# EAGLE schematic panda-2 (EAGLE 9.6.2)

## Sheet 1 of 2
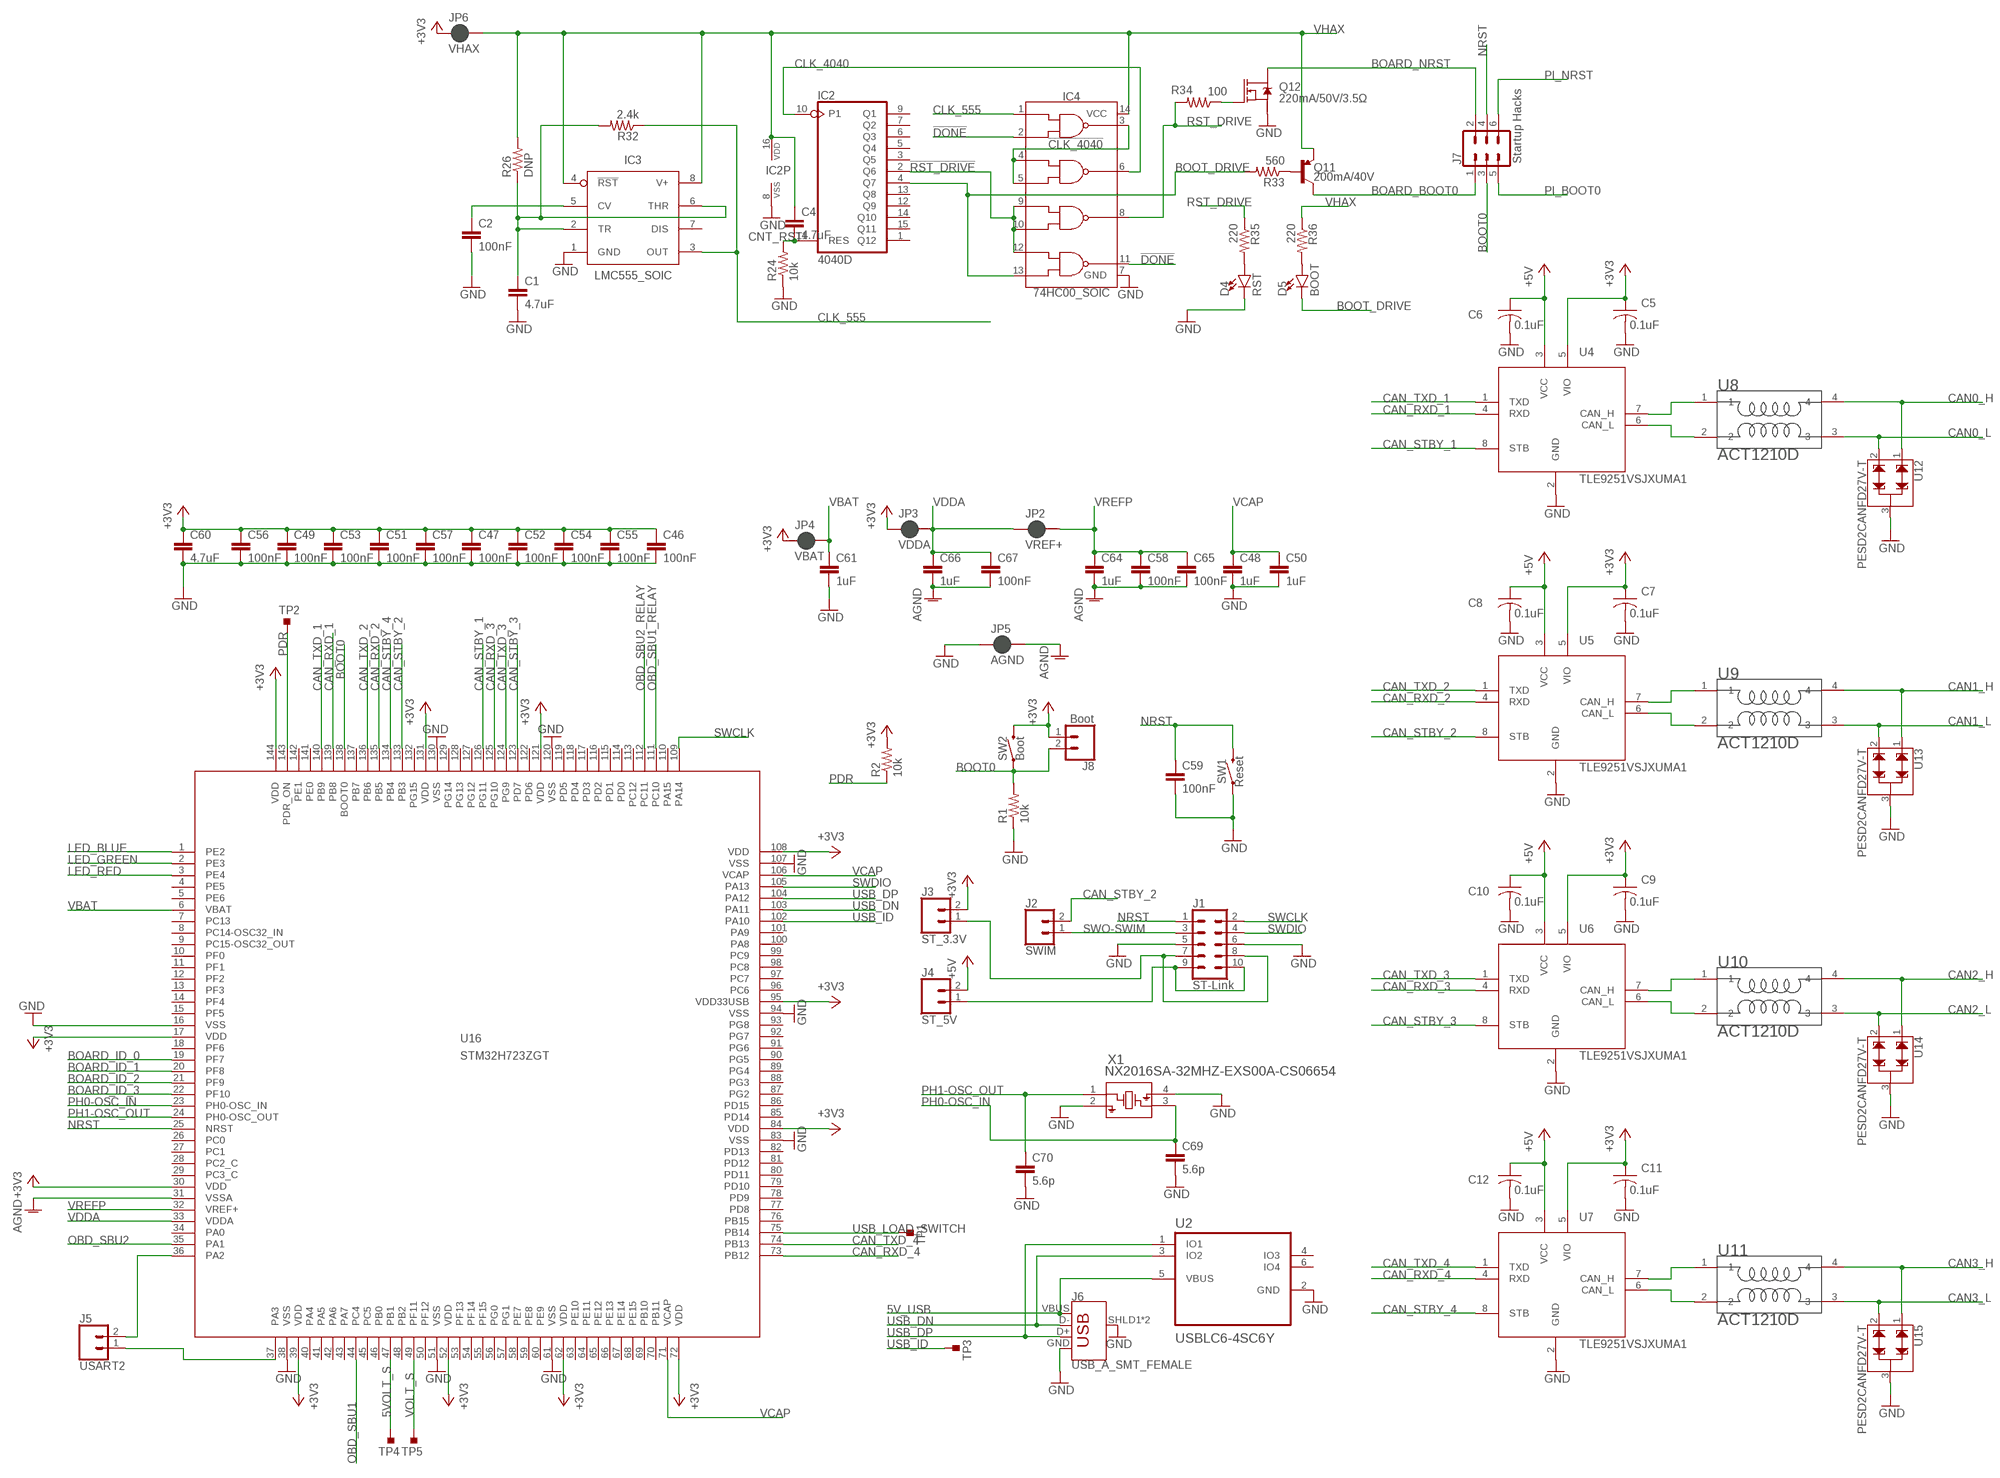
[diagram p0: schematic, sheet 1, part 1 of 2]
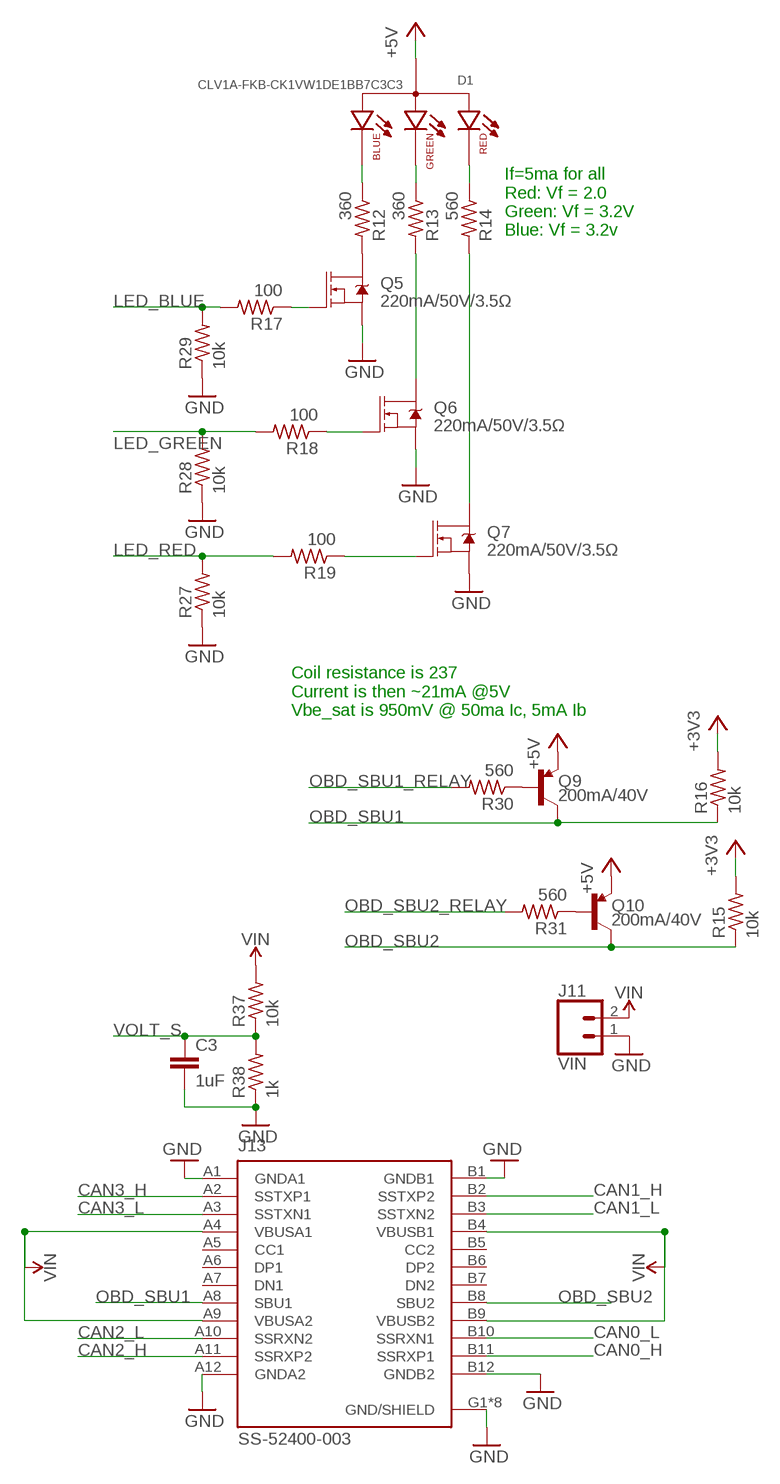
[diagram p1: schematic, sheet 1, part 2 of 2]

### Parts
C1  4.7uF  C-EUC0603  [C0603]
C2  100nF  C-EUC0402  [C0402]
C3  1uF  C-EUC0402  [C0402]
C4  4.7uF  C-EUC0603  [C0603]
C5  0.1uF  C-USC0402  [C0402]
C6  0.1uF  C-USC0402  [C0402]
C7  0.1uF  C-USC0402  [C0402]
C8  0.1uF  C-USC0402  [C0402]
C9  0.1uF  C-USC0402  [C0402]
C10  0.1uF  C-USC0402  [C0402]
C11  0.1uF  C-USC0402  [C0402]
C12  0.1uF  C-USC0402  [C0402]
C46  100nF  C-EUC0402  [C0402]
C47  100nF  C-EUC0402  [C0402]
C48  1uF  C-EUC0402  [C0402]
C49  100nF  C-EUC0402  [C0402]
C50  1uF  C-EUC0402  [C0402]
C51  100nF  C-EUC0402  [C0402]
C52  100nF  C-EUC0402  [C0402]
C53  100nF  C-EUC0402  [C0402]
C54  100nF  C-EUC0402  [C0402]
C55  100nF  C-EUC0402  [C0402]
C56  100nF  C-EUC0402  [C0402]
C57  100nF  C-EUC0402  [C0402]
C58  100nF  C-EUC0402  [C0402]
C59  100nF  C-EUC0402  [C0402]
C60  4.7uF  C-EUC0603  [C0603]
C61  1uF  C-EUC0402  [C0402]
C64  1uF  C-EUC0402  [C0402]
C65  100nF  C-EUC0402  [C0402]
C66  1uF  C-EUC0402  [C0402]
C67  100nF  C-EUC0402  [C0402]
C69  5.6p  C-EUC0402  [C0402]
C70  5.6p  C-EUC0402  [C0402]
D1  CLV1A-FKB-CK1VW1DE1BB7C3C3  [LED_CLV1A-FKB-CK1VW1DE1BB7C3C3]
D4  RST  LED-RED0603  [LED-0603]
D5  BOOT  LED-RED0603  [LED-0603]
IC2  4040D  [SO16]
IC3  LMC555_SOIC  [SOIC127P599X175-8N]
IC4  74HC00_SOIC  [SOIC127P600X175-14N]
J1  ST-Link  CONN_05X2SHD-NS  [2X5-SHROUDED-NS]
J2  SWIM  CONN_02  [1X02]
J3  ST_3.3V  CONN_02  [1X02]
J4  ST_5V  CONN_02  [1X02]
J5  USART2  CONN_02  [1X02]
J6  USB_A_SMT_FEMALE  [USB-A-S-SILK-FEMALE]
J7  Startup Hacks  CONN_03X2FEMALE  [2X3]
J8  Boot  CONN_02  [1X02]
J11  VIN  CONN_02  [1X02]
J13  SS-52400-003  [BELFUSE_SS-52400-003]
JP2  VREF+  JUMPER-SMT_2_NC_PASTE_SILK  [SMT-JUMPER_2_NC_PASTE_SILK]
JP3  VDDA  JUMPER-SMT_2_NC_PASTE_SILK  [SMT-JUMPER_2_NC_PASTE_SILK]
JP4  VBAT  JUMPER-SMT_2_NC_PASTE_SILK  [SMT-JUMPER_2_NC_PASTE_SILK]
JP5  AGND  JUMPER-SMT_2_NC_PASTE_SILK  [SMT-JUMPER_2_NC_PASTE_SILK]
JP6  VHAX  JUMPER-SMT_2_NC_PASTE_SILK  [SMT-JUMPER_2_NC_PASTE_SILK]
Q5  220mA/50V/3.5Ω  MOSFET-NCH-BSS138  [SOT23-3]
Q6  220mA/50V/3.5Ω  MOSFET-NCH-BSS138  [SOT23-3]
Q7  220mA/50V/3.5Ω  MOSFET-NCH-BSS138  [SOT23-3]
Q9  200mA/40V  TRANS_PNP-PMBT3906|MMBT3906L  [SOT23-3]
Q10  200mA/40V  TRANS_PNP-PMBT3906|MMBT3906L  [SOT23-3]
Q11  200mA/40V  TRANS_PNP-PMBT3906|MMBT3906L  [SOT23-3]
Q12  220mA/50V/3.5Ω  MOSFET-NCH-BSS138  [SOT23-3]
R1  10k  R-US_R0402  [R0402]
R2  10k  R-US_R0402  [R0402]
R12  360  R-US_R0402  [R0402]
R13  360  R-US_R0402  [R0402]
R14  560  R-US_R0402  [R0402]
R15  10k  R-US_R0402  [R0402]
R16  10k  R-US_R0402  [R0402]
R17  100  R-US_R0402  [R0402]
R18  100  R-US_R0402  [R0402]
R19  100  R-US_R0402  [R0402]
R24  10k  R-US_R0402  [R0402]
R26  DNP  R-US_R0402  [R0402]
R27  10k  R-US_R0402  [R0402]
R28  10k  R-US_R0402  [R0402]
R29  10k  R-US_R0402  [R0402]
R30  560  R-US_R0402  [R0402]
R31  560  R-US_R0402  [R0402]
R32  2.4k  R-US_R0402  [R0402]
R33  560  R-US_R0402  [R0402]
R34  100  R-US_R0402  [R0402]
R35  220  R-US_R0402  [R0402]
R36  220  R-US_R0402  [R0402]
R37  10k  R-US_R0402  [R0402]
R38  1k  R-US_R0402  [R0402]
SW1  Reset  MOMENTARY-SWITCH-SPST-PTH-6.0MM  [TACTILE_SWITCH_PTH_6.0MM]
SW2  Boot  MOMENTARY-SWITCH-SPST-PTH-6.0MM  [TACTILE_SWITCH_PTH_6.0MM]
TP1  USB_LOAD_SWITCH  TESTPOINT_TPS-SMD-10SN  [TESTPOINT_SMD-10SN]
TP2  PDR_ON  TESTPOINT_TPS-SMD-10SN  [TESTPOINT_SMD-10SN]
TP3  USB_ID  TESTPOINT_TPS-SMD-10SN  [TESTPOINT_SMD-10SN]
TP4  5VOUT_S  TESTPOINT_TPS-SMD-10SN  [TESTPOINT_SMD-10SN]
TP5  VOLT_S  TESTPOINT_TPS-SMD-10SN  [TESTPOINT_SMD-10SN]
U2  USBLC6-4SC6Y  [SOT95P280X145-6N]
U4  TLE9251VSJXUMA1  [SOIC8]
U5  TLE9251VSJXUMA1  [SOIC8]
U6  TLE9251VSJXUMA1  [SOIC8]
U7  TLE9251VSJXUMA1  [SOIC8]
U8  ACT1210D  [ACT1210-101-2P-TL]
U9  ACT1210D  [ACT1210-101-2P-TL]
U10  ACT1210D  [ACT1210-101-2P-TL]
U11  ACT1210D  [ACT1210-101-2P-TL]
U12  PESD2CANFD27V-T  [DBZ_R-PDSO-G3]
U13  PESD2CANFD27V-T  [DBZ_R-PDSO-G3]
U14  PESD2CANFD27V-T  [DBZ_R-PDSO-G3]
U15  PESD2CANFD27V-T  [DBZ_R-PDSO-G3]
U16  STM32H723ZGT  [LQFP-144]
X1  NX2016SA-32MHZ-EXS00A-CS06654  [NX2016SA_NDK]

### Nets
5V_USB: J6.VBUS U2.5(VBUS) ; also sheet 2
5VOLT_S: TP4.TP U16.47(PB1)
!CLK_4040: IC4.3(1Y) IC4.4(2A) IC4.5(2B)
!DONE: IC4.2(1B) IC4.11(4Y)
!RST_DRIVE: IC2.2(Q6) IC4.9(3A) IC4.10(3B) IC4.12(4A)
+3V3: C5.1 C7.1 C9.1 C11.1 C46.1 C47.1 C49.1 C51.1 C52.1 C53.1 C54.1 C55.1 C56.1 C57.1 C60.1 J3.2 J8.1 JP3.1 JP4.1 JP6.1 R2.2 R15.2 R16.2 SW2.3 U4.5(VIO) U5.5(VIO) U6.5(VIO) U7.5(VIO) U16.17(VDD) U16.30(VDD) U16.39(VDD) U16.52(VDD) U16.62(VDD) U16.72(VDD) U16.84(VDD) U16.95(VDD33USB) U16.108(VDD) U16.121(VDD) U16.131(VDD) U16.144(VDD) ; also sheet 2
+5V: C6.1 C8.1 C10.1 C12.1 D1.2(A) J4.2 Q9.2(E) Q10.2(E) U4.3(VCC) U5.3(VCC) U6.3(VCC) U7.3(VCC) ; also sheet 2
AGND: C58.2 C64.2 C65.2 C66.2 C67.2 JP5.2 U16.31(VSSA)
BOARD_BOOT0: J7.1 Q11.3(C)
BOARD_ID_0: U16.19(PF7)
BOARD_ID_1: U16.20(PF8)
BOARD_ID_2: U16.21(PF9)
BOARD_ID_3: U16.22(PF10)
BOARD_NRST: J7.2 Q12.3(D)
BOOT0: J7.3 J8.2 R1.2 SW2.1 U16.138(BOOT0)
BOOT_DRIVE: D5.C IC2.4(Q7) IC4.13(4B) R33.2
CAN0_H: J13.B11(SSRXP1) U8.4 U12.1
CAN0_L: J13.B10(SSRXN1) U8.3 U12.2
CAN1_H: J13.B2(SSTXP2) U9.4 U13.1
CAN1_L: J13.B3(SSTXN2) U9.3 U13.2
CAN2_H: J13.A11(SSRXP2) U10.4 U14.1
CAN2_L: J13.A10(SSRXN2) U10.3 U14.2
CAN3_H: J13.A2(SSTXP1) U11.4 U15.1
CAN3_L: J13.A3(SSTXN1) U11.3 U15.2
CAN_RXD_1: U4.4(RXD) U16.139(PB8)
CAN_RXD_2: U5.4(RXD) U16.135(PB5)
CAN_RXD_3: U6.4(RXD) U16.125(PG10)
CAN_RXD_4: U7.4(RXD) U16.73(PB12)
CAN_STBY_1: U4.8(STB) U16.126(PG11)
CAN_STBY_2: J2.2 U5.8(STB) U16.133(PB3)
CAN_STBY_3: U6.8(STB) U16.123(PD7)
CAN_STBY_4: U7.8(STB) U16.134(PB4)
CAN_TXD_1: U4.1(TXD) U16.140(PB9)
CAN_TXD_2: U5.1(TXD) U16.136(PB6)
CAN_TXD_3: U6.1(TXD) U16.124(PG9)
CAN_TXD_4: U7.1(TXD) U16.74(PB13)
CLK_555: IC3.3(OUT) IC4.1(1A) R32.1
CLK_4040: IC2.10(P1) IC4.6(2Y)
CNT_RST: C4.2 IC2.11(RES) R24.2
GND: C1.2 C2.2 C3.2 C5.2 C6.2 C7.2 C8.2 C9.2 C10.2 C11.2 C12.2 C46.2 C47.2 C48.2 C49.2 C50.2 C51.2 C52.2 C53.2 C54.2 C55.2 C56.2 C57.2 C59.2 C60.2 C61.2 C69.2 C70.2 D4.C IC2.8(VSS) IC3.1(GND) IC4.7(GND) J1.5 J1.6 J6.GND J6.SHLD1(SHIELD) J6.SHLD2(SHIELD) J11.1 J13.A1(GNDA1) J13.A12(GNDA2) J13.B1(GNDB1) J13.B12(GNDB2) J13.G1(GND/SHIELD) J13.G2(GND/SHIELD) J13.G3(GND/SHIELD) J13.G4(GND/SHIELD) J13.S1(GND/SHIELD) J13.S2(GND/SHIELD) J13.S3(GND/SHIELD) J13.S4(GND/SHIELD) JP5.1 Q5.2(S) Q6.2(S) Q7.2(S) Q12.2(S) R1.1 R24.1 R27.1 R28.1 R29.1 R38.1 SW1.1 U2.2(GND) U4.2(GND) U5.2(GND) U6.2(GND) U7.2(GND) U12.3 U13.3 U14.3 U15.3 U16.16(VSS) U16.38(VSS) U16.51(VSS) U16.61(VSS) U16.83(VSS) U16.94(VSS) U16.107(VSS) U16.120(VSS) U16.130(VSS) X1.2 X1.4 ; also sheet 2
LED_BLUE: R17.2 R29.2 U16.1(PE2)
LED_GREEN: R18.2 R28.2 U16.2(PE3)
LED_RED: R19.2 R27.2 U16.3(PE4)
N$1: U4.7(CAN_H) U8.1
N$2: U4.6(CAN_L) U8.2
N$3: U5.7(CAN_H) U9.1
N$4: U5.6(CAN_L) U9.2
N$5: U6.7(CAN_H) U10.1
N$6: U6.6(CAN_L) U10.2
N$7: U7.7(CAN_H) U11.1
N$8: U7.6(CAN_L) U11.2
N$9: J1.7 J1.8 J3.1
N$11: J1.9 J1.10 J4.1
N$12: Q5.3(D) R12.2
N$13: D1.3(B_C) R12.1
N$14: D1.4(G_C) R13.1
N$15: D1.1(R_C) R14.1
N$16: Q6.3(D) R13.2
N$17: Q7.3(D) R14.2
N$18: Q9.1(B) R30.1
N$19: Q5.1(G) R17.1
N$20: Q6.1(G) R18.1
N$21: Q7.1(G) R19.1
N$22: D4.A R35.2
N$23: D5.A R36.2
N$29: J5.2 U16.36(PA2)
N$30: J5.1 U16.37(PA3)
N$31: Q10.1(B) R31.1
N$35: C1.1 IC3.2(TR) IC3.6(THR) R26.1 R32.2
N$37: C2.1 IC3.5(CV)
N$44: Q11.1(B) R33.1
N$45: Q12.1(G) R34.1
NRST: C59.1 J1.1 J7.4 SW1.3 U16.25(NRST)
OBD_SBU1: J13.A8(SBU1) Q9.3(C) R16.1 U16.44(PC4)
OBD_SBU1_RELAY: R30.2 U16.111(PC10)
OBD_SBU2: J13.B8(SBU2) Q10.3(C) R15.1 U16.35(PA1)
OBD_SBU2_RELAY: R31.2 U16.112(PC11)
PDR: R2.1 TP2.TP U16.143(PDR_ON)
PH0-OSC_IN: C69.1 U16.23(PH0-OSC_IN) X1.3
PH1-OSC_OUT: C70.1 U16.24(PH0-OSC_OUT) X1.1
PI_BOOT0: J7.5 ; also sheet 2
PI_NRST: J7.6 ; also sheet 2
RST_DRIVE: IC4.8(3Y) R34.2 R35.1
SWCLK: J1.2 U16.109(PA14)
SWDIO: J1.4 U16.105(PA13)
SWO-SWIM: J1.3 J2.1
USB_DN: J6.D- U2.3(IO2) U16.103(PA11)
USB_DP: J6.D+ U2.1(IO1) U16.104(PA12)
USB_ID: TP3.TP U16.102(PA10)
USB_LOAD_SWITCH: TP1.TP U16.75(PB14)
VBAT: C61.1 JP4.2 U16.6(VBAT)
VCAP: C48.1 C50.1 U16.71(VCAP) U16.106(VCAP)
VDDA: C66.1 C67.1 JP2.1 JP3.2 U16.33(VDDA)
VHAX: C4.1 IC2.16(VDD) IC3.4(!RST) IC3.8(V+) IC4.14(VCC) JP6.2 Q11.2(E) R26.2 R36.1
VIN: J11.2 J13.A4(VBUSA1) J13.A9(VBUSA2) J13.B4(VBUSB1) J13.B9(VBUSB2) R37.2
VOLT_S: C3.1 R37.1 R38.2 TP5.TP U16.49(PF11)
VREFP: C58.1 C64.1 C65.1 JP2.2 U16.32(VREF+)
Unconnected: IC2.1(Q12) IC2.3(Q5) IC2.5(Q4) IC2.6(Q3) IC2.7(Q2) IC2.9(Q1) IC2.12(Q9) IC2.13(Q8) IC2.14(Q10) IC2.15(Q11) IC3.7(DIS) J13.A5(CC1) J13.A6(DP1) J13.A7(DN1) J13.B5(CC2) J13.B6(DP2) J13.B7(DN2) U2.4(IO3) U2.6(IO4) U16.4(PE5) U16.5(PE6) U16.7(PC13) U16.8(PC14-OSC32_IN) U16.9(PC15-OSC32_OUT) U16.10(PF0) U16.11(PF1) U16.12(PF2) U16.13(PF3) U16.14(PF4) U16.15(PF5) U16.18(PF6) U16.26(PC0) U16.27(PC1) U16.28(PC2_C) U16.29(PC3_C) U16.34(PA0) U16.40(PA4) U16.41(PA5) U16.42(PA6) U16.43(PA7) U16.45(PC5) U16.46(PB0) U16.48(PB2) U16.50(PF12) U16.53(PF13) U16.54(PF14) U16.55(PF15) U16.56(PG0) U16.57(PG1) U16.58(PE7) U16.59(PE8) U16.60(PE9) U16.63(PE10) U16.64(PE11) U16.65(PE12) U16.66(PE13) U16.67(PE14) U16.68(PE15) U16.69(PB10) U16.70(PB11) U16.76(PB15) U16.77(PD8) U16.78(PD9) U16.79(PD10) U16.80(PD11) U16.81(PD12) U16.82(PD13) U16.85(PD14) U16.86(PD15) U16.87(PG2) U16.88(PG3) U16.89(PG4) U16.90(PG5) U16.91(PG6) U16.92(PG7) U16.93(PG8) U16.96(PC6) U16.97(PC7) U16.98(PC8) U16.99(PC9) U16.100(PA8) U16.101(PA9) U16.110(PA15) U16.113(PC12) U16.114(PD0) U16.115(PD1) U16.116(PD2) U16.117(PD3) U16.118(PD4) U16.119(PD5) U16.122(PD6) U16.127(PG12) U16.128(PG13) U16.129(PG14) U16.132(PG15) U16.137(PB7) U16.141(PE0) U16.142(PE1)

### Notes on the sheet
- If=5ma for all
  Red: Vf = 2.0
  Green: Vf = 3.2V
  Blue: Vf = 3.2v
- Coil resistance is 237
  Current is then ~21mA @5V
  Vbe_sat is 950mV @ 50ma Ic, 5mA Ib

## Sheet 2 of 2
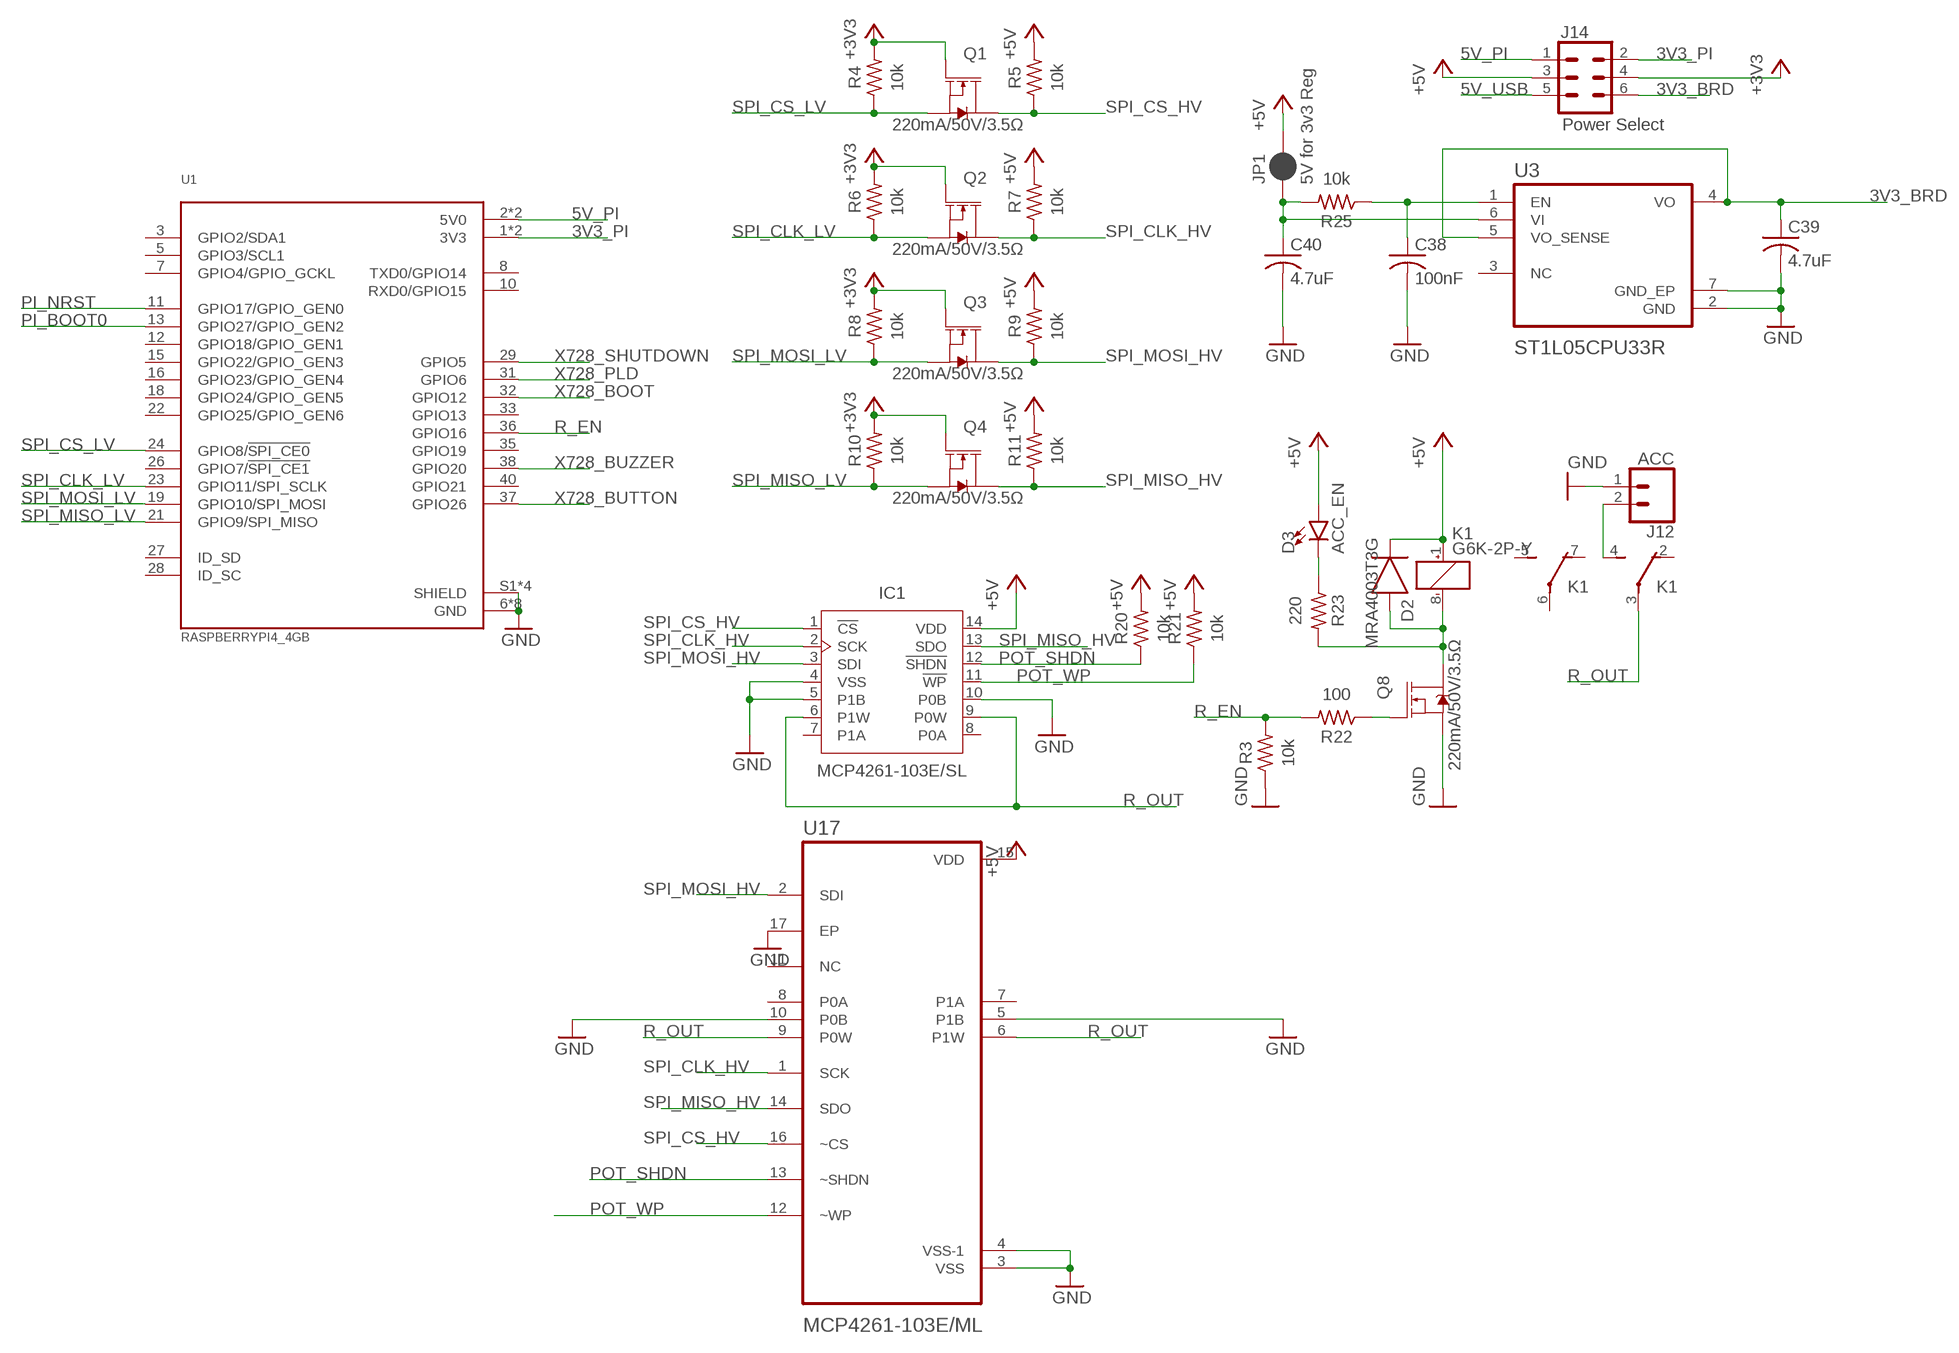
[diagram p2: schematic, sheet 2]

### Parts
C38  100nF  C-US_CHIP-0402(1005-METRIC)  [CAPC1005X60]
C39  4.7uF  C-US_CHIP-0603(1608-METRIC)  [CAPC1608X85]
C40  4.7uF  C-US_CHIP-0603(1608-METRIC)  [CAPC1608X85]
D2  MRA4003T3G  DIODE_MRA4003T3G_SMA  [DIOM5226X290N]
D3  ACC_EN  LED-RED0603  [LED-0603]
IC1  MCP4261-103E/SL  MCP4261-103E/SLSOIC-14  [SOIC127P600X175-14N]
J12  ACC  CONN_025MM  [SCREWTERMINAL-5MM-2]
J14  Power Select  CONN_03X2FEMALE  [2X3]
JP1  5V for 3v3 Reg  JUMPER-SMT_2_NC_PASTE_SILK  [SMT-JUMPER_2_NC_PASTE_SILK]
K1  G6K-2P-Y  [G6K-2P-Y]
Q1  220mA/50V/3.5Ω  MOSFET-NCH-BSS138  [SOT23-3]
Q2  220mA/50V/3.5Ω  MOSFET-NCH-BSS138  [SOT23-3]
Q3  220mA/50V/3.5Ω  MOSFET-NCH-BSS138  [SOT23-3]
Q4  220mA/50V/3.5Ω  MOSFET-NCH-BSS138  [SOT23-3]
Q8  220mA/50V/3.5Ω  MOSFET-NCH-BSS138  [SOT23-3]
R3  10k  R-US_CHIP-0402(1005-METRIC)  [RESC1005X40]
R4  10k  R-US_CHIP-0402(1005-METRIC)  [RESC1005X40]
R5  10k  R-US_CHIP-0402(1005-METRIC)  [RESC1005X40]
R6  10k  R-US_CHIP-0402(1005-METRIC)  [RESC1005X40]
R7  10k  R-US_CHIP-0402(1005-METRIC)  [RESC1005X40]
R8  10k  R-US_CHIP-0402(1005-METRIC)  [RESC1005X40]
R9  10k  R-US_CHIP-0402(1005-METRIC)  [RESC1005X40]
R10  10k  R-US_CHIP-0402(1005-METRIC)  [RESC1005X40]
R11  10k  R-US_CHIP-0402(1005-METRIC)  [RESC1005X40]
R20  10k  R-US_CHIP-0402(1005-METRIC)  [RESC1005X40]
R21  10k  R-US_CHIP-0402(1005-METRIC)  [RESC1005X40]
R22  100  R-US_CHIP-0402(1005-METRIC)  [RESC1005X40]
R23  220  R-US_CHIP-0402(1005-METRIC)  [RESC1005X40]
R25  10k  R-US_CHIP-0402(1005-METRIC)  [RESC1005X40]
U1  RASPBERRYPI4_4GB  [MODULE_RASPBERRYPI4_4GB]
U3  ST1L05CPU33R  [SON95P300X300X100-7N]
U17  MCP4261-103E/ML  [QFN65P400X400X100-17N]

### Nets
3V3_BRD: C39.1 J14.6 U3.4(VO) U3.5(VO_SENSE)
3V3_PI: J14.2 U1.1(3V3) U1.17(3V3)
5V_PI: J14.1 U1.2(5V0) U1.4(5V0)
5V_USB: J14.5 ; also sheet 1
+3V3: J14.4 Q1.1(G) Q2.1(G) Q3.1(G) Q4.1(G) R4.2 R6.2 R8.2 R10.2 ; also sheet 1
+5V: D2.1(C) D3.A IC1.14(VDD) J14.3 JP1.2 K1.1(1:+) R5.2 R7.2 R9.2 R11.2 R20.2 R21.2 U17.15(VDD) ; also sheet 1
GND: C38.2 C39.2 C40.2 IC1.4(VSS) IC1.5(P1B) IC1.10(P0B) J12.1 Q8.2(S) R3.1 U1.6(GND) U1.9(GND) U1.14(GND) U1.20(GND) U1.25(GND) U1.30(GND) U1.34(GND) U1.39(GND) U1.S1(SHIELD) U1.S2(SHIELD) U1.S3(SHIELD) U1.S4(SHIELD) U3.2(GND) U3.7(GND_EP) U17.3(VSS) U17.4(VSS-1) U17.5(P1B) U17.10(P0B) U17.17(EP) ; also sheet 1
N$10: J12.2 K1.4(2:S)
N$24: D3.C R23.1
N$25: D2.2(A) K1.8(1:-) Q8.3(D) R23.2
N$26: Q8.1(G) R22.1
N$27: C38.1 R25.1 U3.1(EN)
N$28: C40.1 JP1.1 R25.2 U3.6(VI)
PI_BOOT0: U1.13(GPIO27/GPIO_GEN2) ; also sheet 1
PI_NRST: U1.11(GPIO17/GPIO_GEN0) ; also sheet 1
POT_SHDN: IC1.12(!SHDN) R20.1 U17.13(~SHDN)
POT_WP: IC1.11(!WP) R21.1 U17.12(~WP)
R_EN: R3.2 R22.2 U1.36(GPIO16)
R_OUT: IC1.6(P1W) IC1.9(P0W) K1.3(2:P) U17.6(P1W) U17.9(P0W)
SPI_CLK_HV: IC1.2(SCK) Q2.3(D) R7.1 U17.1(SCK)
SPI_CLK_LV: Q2.2(S) R6.1 U1.23(GPIO11/SPI_SCLK)
SPI_CS_HV: IC1.1(!CS) Q1.3(D) R5.1 U17.16(~CS)
SPI_CS_LV: Q1.2(S) R4.1 U1.24(GPIO8/!SPI_CE0!)
SPI_MISO_HV: IC1.13(SDO) Q4.3(D) R11.1 U17.14(SDO)
SPI_MISO_LV: Q4.2(S) R10.1 U1.21(GPIO9/SPI_MISO)
SPI_MOSI_HV: IC1.3(SDI) Q3.3(D) R9.1 U17.2(SDI)
SPI_MOSI_LV: Q3.2(S) R8.1 U1.19(GPIO10/SPI_MOSI)
X728_BOOT: U1.32(GPIO12)
X728_BUTTON: U1.37(GPIO26)
X728_BUZZER: U1.38(GPIO20)
X728_PLD: U1.31(GPIO6)
X728_SHUTDOWN: U1.29(GPIO5)
Unconnected: IC1.7(P1A) IC1.8(P0A) K1.2(2:O) K1.5(3:S) K1.6(3:P) K1.7(3:O) U1.3(GPIO2/SDA1) U1.5(GPIO3/SCL1) U1.7(GPIO4/GPIO_GCKL) U1.8(TXD0/GPIO14) U1.10(RXD0/GPIO15) U1.12(GPIO18/GPIO_GEN1) U1.15(GPIO22/GPIO_GEN3) U1.16(GPIO23/GPIO_GEN4) U1.18(GPIO24/GPIO_GEN5) U1.22(GPIO25/GPIO_GEN6) U1.26(GPIO7/!SPI_CE1!) U1.27(ID_SD) U1.28(ID_SC) U1.33(GPIO13) U1.35(GPIO19) U1.40(GPIO21) U3.3(NC) U17.7(P1A) U17.8(P0A) U17.11(NC)

## Library data of the parts
C1-C4 C46-C61 C64-C67 C69 C70 = rcl:C-EU: CAPACITOR, European symbol; SPICEPREFIX: C
C5-C12 = rcl:C-US: CAPACITOR, American symbol; SPICEPREFIX: C
C38-C40 = Capacitor:C-US: Capacitor - ANSI; CATEGORY: Capacitor
D1 = CLV1A-FKB-CK1VW1DE1BB7C3C3:CLV1A-FKB-CK1VW1DE1BB7C3C3: PLCC4 3 in 1 SMD LED Check availability <https://pricing.snapeda.com/parts/CLV1A-FKB-CK1VW1DE1BB7C3C3/Cree%20Inc./view-part?ref=eda>; AVAILABILITY: In Stock; DESCRIPTION: Red, Green, Blue (RGB) 622nm Red, 528nm Green, 468nm Blue LED Indication - Discrete 2V Red, 3.2V Green, 3.2V Blue 4-PLCC; MF: Cree Inc.; MP: CLV1A-FKB-CK1VW1DE1BB7C3C3; PACKAGE: PLCC-4 Cree Inc.; PRICE: None; PURCHASE-URL: https://pricing.snapeda.com/search/part/CLV1A-FKB-CK1VW1DE1BB7C3C3/?ref=eda
D2 = Diode:DIODE_: Diode Rectifier - Popular parts; CATEGORY: Diode; DESCRIPTION: DIODE GEN PURP 300V 1A SMA; MANUFACTURER: ON Semiconductor; SUB-CATEGORY: Rectifier
D3-D5 = SparkFun-LED:LED-RED: Red SMD LED Used in manufacturing of most products at SparkFun Packages: 0603 - SMD 0603 package [Product Link] <http://docs.avagotech.com/docs/AV02-0551EN> 0603 SMART - SMD 0603 SMART package ( more efficient and expensive)[Product Link] <http://www.osram-os.com/Graphics/XPic2/00077099_0.pdf> 1206 - SMD1206 package [Product Link] <https://www.sparkfun.com/datasheets/DevTools/LilyPad/Q150OVS4.pdff> SparkFun Products: Pro Mini 328 -5V <https://www.sparkfun.com/products/821> RedBoard <https://www.sparkfun.com/products/12757> IOIO-OTG <https://www.sparkfun.com/products/13613>; PROD_ID: DIO-00819; VALUE: RED
IC1 = IC_Data-Conversion:MCP42*: 7/8-Bit Single/Dual SPI Digital POT with Volatile Memory Datasheet <http://ww1.microchip.com/downloads/en/devicedoc/22060b.pdf>; CATEGORY: IC_Data-Conversion; MANUFACTURER: Microchip Technology; MPN: MCP4261-103E/SL; OPERATING_TEMPERATURE: -40°C ~ 125°C; PART_STATUS: ACTIVE; ROHS_COMPLIANT: COMPLIANT; SERIES: MCP42X; SUB_CATEGORY: Digital Potentiometer; THERMALLOSS: 0.4 W
IC2 = 40xx:4040: 12-stage binary/ripple COUNTER
IC3 = Tinkercad:*555: TIMER 555 General purpose precision timers NE555 : Texas Datasheet <http://www.ti.com/general/docs/suppproductinfo.tsp?distId=10&gotoUrl=http%3A%2F%2Fwww.ti.com%2Flit%2Fgpn%2Fne555>, Diodes Incorporated Datasheet <https://www.diodes.com/assets/Datasheets/NE555_SA555_NA555.pdf> LM555 Datasheet <http://www.ti.com/general/docs/suppproductinfo.tsp?distId=10&gotoUrl=http%3A%2F%2Fwww.ti.com%2Flit%2Fgpn%2Flm555> LMC555 Datasheet <http://www.ti.com/general/docs/suppproductinfo.tsp?distId=10&gotoUrl=http%3A%2F%2Fwww.ti.com%2Flit%2Fgpn%2Flmc555> ICM7555 : Maxim Integrated Datasheet <https://datasheets.maximintegrated.com/en/ds/ICM7555-ICM7556.pdf>, Renesas Electronics America Inc Datasheet <https://www.renesas.com/en-us/www/doc/datasheet/icm7555-56.pdf>; CATEGORY: IC_Clock-Timing; CURRENT-SUPPLY: 150µA; DESCRIPTION: IC OSC SINGLE TIMER 3MHZ 8-SOIC; FREQUENCY: 3MHz; MANUFACTURER: Texas Instruments; MPN: LMC555CM/NOPB; OPERATING_TEMP: -40°C to 85°C; PART_STATUS: Active; ROHS_COMPLIANT: ROHS3 Compliant; SUB-CATEGORY: Timer
IC4 = IC_Logic:74HC00: Quadruple 2-Input NAND Gate Reference Datasheet <https://www.ti.com/lit/ds/symlink/sn74hc00.pdf?ts=1637559744705>; CATEGORY: IC_Logic; DESCRIPTION: Quadruple 2-Input NAND Gate; MANUFACTURER: Generic; MPN: Generic; SUB-CATEGORY: GATE; TYPE: NAND
J1 = SparkFun-Connectors:CONN_05X2: Multi connection point. Often used as Generic Header-pin footprint for 0.1 inch spaced/style header connections For AVR SPI programming port, see special device with nice symbol: "AVR_SPI_PROG_5x2.dev" You can populate with any combo of single row headers, but if you'd like an exact match, check these: 2x5 AVR ICSP Male Header <https://www.sparkfun.com/products/778> (PRT-00778) 2x5 Pin Shrouded Header <https://www.sparkfun.com/products/8506> (PRT-08506) On any of the 0.1 inch spaced packages, you can populate with these: Break Away Headers - Straight <https://www.sparkfun.com/products/116> (PRT-00116) Break Away Male Headers - Right Angle <https://www.sparkfun.com/products/553> (PRT-00553) Female Headers <https://www.sparkfun.com/products/115> (PRT-00115) Break Away Headers - Machine Pin <https://www.sparkfun.com/products/117> (PRT-00117) Break Away Female Headers - Swiss Machine Pin <https://www.sparkfun.com/products/743> (PRT-00743) Special note: the shrouded connector mates well with our 5x2 ribbon cables: 2x5 Pin IDC Ribbon Cable <https://www.sparkfun.com/products/8535> (PRT-08535); PROD_ID: CONN-08671; SF_ID: PRT-08506
J2-J5 J8 J11 = SparkFun-Connectors:CONN_02: Multi connection point. Often used as Generic Header-pin footprint for 0.1 inch spaced/style header connections On any of the 0.1 inch spaced packages, you can populate with these: Break Away Headers - Straight <https://www.sparkfun.com/products/116> (PRT-00116) Break Away Male Headers - Right Angle <https://www.sparkfun.com/products/553> (PRT-00553) Female Headers <https://www.sparkfun.com/products/115> (PRT-00115) Break Away Headers - Machine Pin <https://www.sparkfun.com/products/117> (PRT-00117) Break Away Female Headers - Swiss Machine Pin <https://www.sparkfun.com/products/743> (PRT-00743) For SCREWTERMINALS and SPRING TERMINALS visit here: Screw Terimnals on SparkFun.com <https://www.sparkfun.com/search/results?term=Screw+Terminals> (5mm/3.5mm/2.54mm spacing) This device is also useful as a general connection point to wire up your design to another part of your project. Our various solder wires solder well into these plated through hole pads. Hook-Up Wire - Assortment (Stranded, 22 AWG) <https://www.sparkfun.com/products/11375> (PRT-11375) Hook-Up Wire - Assortment (Solid Core, 22 AWG) <https://www.sparkfun.com/products/11367> (PRT-11367) View the entire wire category on our website here <https://www.sparkfun.com/categories/141> Special notes: Molex polarized connector foot print use with: PRT-08233 with associated crimp pins and housings. 2.54_SCREWTERM for use with PRT-10571. 3.5mm Screw Terminal footprints for PRT-08084 5mm Screw Terminal footprints for use with PRT-08432
J6 = SparkFun-Connectors:USB_A: USB-A Connector Male and female variants, as well as PTH and SMT variants SparkFun Products: SparkFun XBee Explorer Dongle <https://www.sparkfun.com/products/11697> PTH Male SparkFun MicroView-USB Programmer <https://www.sparkfun.com/products/12924> SMT Male SparkFun USB Type A Female Breakout <https://www.sparkfun.com/products/12700> SMT Female; PROD_ID: CONN-09520; SF_ID: PRT-09011
J7 J14 = SparkFun-Connectors:CONN_03X2: Multi connection point. Often used as Generic Header-pin footprint for 0.1 inch spaced/style header connections You can populate with any combo of single row headers, but if you'd like an exact match, check these: Header - 2x3 (Male, 0.1") <https://www.sparkfun.com/products/12807> (PRT-12807) Header - 2x3 (Female, 0.1") <https://www.sparkfun.com/products/13010> (PRT-13010) 2x3 Pin Shrouded Header <https://www.sparkfun.com/products/10877> (PRT-10877) On any of the 0.1 inch spaced packages, you can populate with these: Break Away Headers - Straight <https://www.sparkfun.com/products/116> (PRT-00116) Break Away Male Headers - Right Angle <https://www.sparkfun.com/products/553> (PRT-00553) Female Headers <https://www.sparkfun.com/products/115> (PRT-00115) Break Away Headers - Machine Pin <https://www.sparkfun.com/products/117> (PRT-00117) Break Away Female Headers - Swiss Machine Pin <https://www.sparkfun.com/products/743> (PRT-00743) Special note: the shrouded connector mates well with our 3x2 ribbon cables: Ribbon Crimp Connector - 6-pin (2x3, Female) <https://www.sparkfun.com/products/10651> (PRT-10651) Ribbon Cable - 6 wire (15ft) <https://www.sparkfun.com/products/10646> (PRT-10646); PROD_ID: CONN-11566; VALUE: FEMALE 2x3
J12 = SparkFun-Connectors:CONN_02: Multi connection point. Often used as Generic Header-pin footprint for 0.1 inch spaced/style header connections On any of the 0.1 inch spaced packages, you can populate with these: Break Away Headers - Straight <https://www.sparkfun.com/products/116> (PRT-00116) Break Away Male Headers - Right Angle <https://www.sparkfun.com/products/553> (PRT-00553) Female Headers <https://www.sparkfun.com/products/115> (PRT-00115) Break Away Headers - Machine Pin <https://www.sparkfun.com/products/117> (PRT-00117) Break Away Female Headers - Swiss Machine Pin <https://www.sparkfun.com/products/743> (PRT-00743) For SCREWTERMINALS and SPRING TERMINALS visit here: Screw Terimnals on SparkFun.com <https://www.sparkfun.com/search/results?term=Screw+Terminals> (5mm/3.5mm/2.54mm spacing) This device is also useful as a general connection point to wire up your design to another part of your project. Our various solder wires solder well into these plated through hole pads. Hook-Up Wire - Assortment (Stranded, 22 AWG) <https://www.sparkfun.com/products/11375> (PRT-11375) Hook-Up Wire - Assortment (Solid Core, 22 AWG) <https://www.sparkfun.com/products/11367> (PRT-11367) View the entire wire category on our website here <https://www.sparkfun.com/categories/141> Special notes: Molex polarized connector foot print use with: PRT-08233 with associated crimp pins and housings. 2.54_SCREWTERM for use with PRT-10571. 3.5mm Screw Terminal footprints for PRT-08084 5mm Screw Terminal footprints for use with PRT-08432; SF_SKU: PRT-08432
J13 = SS-52400-003:SS-52400-003: USB Type-C Connector | 1 Port | Right Angle Receptacle | Shielded | 0.039"[1.00mm] Check availability <https://pricing.snapeda.com/parts/SS-52400-003/Stewart%20Connector/view-part?ref=eda>; AVAILABILITY: In Stock; DESCRIPTION: USB Type-C Connector | 1 Port | Right Angle Receptacle | Shielded | 0.063[1.60mm]; MF: Stewart Connector; MP: SS-52400-003; PACKAGE: None; PRICE: None; PURCHASE-URL: https://pricing.snapeda.com/search/part/SS-52400-003/?ref=eda
JP1-JP6 = SparkFun-Jumpers:JUMPER-SMT_2_NC_PASTE: Normally closed solder jumper This jumper has an aperture in the stencil to allow solder paste to bridge the split in the wire so it's normally closed (NC). Wick off the solder to open the connection. Reapply solder to reclose the connection.
K1 = relay:G6K: Low Signal Relay oeiwcsnts1.omron.com/.. D20G6K0100.pdf; MF: OMRON COMPONENTS USA; MPN: G6K-2P-Y DC12; OC_FARNELL: 3937276; OC_NEWARK: 34C3464
Q1-Q8 Q12 = SparkFun-DiscreteSemi:MOSFET-NCH: N-channel MOSFETs Voltage controlled devices that allow control of high current outputs. SparkFun Products: SparkFun OpenScale <https://www.sparkfun.com/products/13261> SparkFun Digital Sandbox <https://www.sparkfun.com/products/12651> SparkFun Monster Moto Shield <https://www.sparkfun.com/products/10182> SparkFun MOSFET Power Controller <https://www.sparkfun.com/products/11214>; PROD_ID: TRANS-00830
Q9-Q11 = SparkFun-DiscreteSemi:TRANS_PNP: PNP transistor Current controlled devices typically used to amplify current or used as a switch. SparkFun Products: SparkFun Serial Enabled 16x2 LCD - Red on Black <https://www.sparkfun.com/products/9068> SparkFun Logomatic <https://www.sparkfun.com/products/12772>; PROD_ID: TRANS-08052
R1 R2 R12-R19 R24 R26-R38 = rcl:R-US_: RESISTOR, American symbol; SPICEPREFIX: R
R3-R11 R20-R23 R25 = Resistor:R-US: Resistor Fixed - ANSI; CATEGORY: Resistor; SUB-CATEGORY: Fixed
SW1 SW2 = SparkFun-Switches:MOMENTARY-SWITCH-SPST: Momentary Switch (Pushbutton) - SPST Normally-open (NO) SPST momentary switches (buttons, pushbuttons). Variants PTH-12MM - 12mm square, through-hole Momentary Pushbutton Switch - 12mm Square <https://www.sparkfun.com/products/9190> (COM-09190) PTH-6.0MM, PTH-6.0MM-KIT - 6.0mm square, through-hole Mini Pushbutton Switch <https://www.sparkfun.com/products/97> (COM-00097) KIT package intended for soldering kit's - only one side of pads' copper is exposed. PTH-RIGHT-ANGLE-KIT - Right-angle, through-hole Right Angle Tactile Button <https://www.sparkfun.com/products/10791> - Used on SparkFun BigTime Watch Kit <https://www.sparkfun.com/products/11734> SMD-12MM - 12mm square, surface-mount Tactile Button - SMD (12mm) <https://www.sparkfun.com/products/12993> (COM-12993) Used on SparkFun PicoBoard <https://www.sparkfun.com/products/11888> SMD-4.5MM - 4.5mm Square Trackball Switch Used on SparkFun Blackberry Trackballer Breakout <https://www.sparkfun.com/products/13169> SMD-4.6MMX2.8MM - 4.60mm x 2.80mm, surface mount Used on SparkFun SAMD21 Mini Breakout <https://www.sparkfun.com/products/13664> SMD-5.2MM, SMD-5.2-REDUNDANT - 5.2mm square, surface-mount Mini Pushbutton Switch - SMD <https://www.sparkfun.com/products/8720> (COM-08720) Used on Arduino Pro Mini <https://www.sparkfun.com/products/11114> REDUNDANT package connects both switch circuits together SMD-6.0X3.5MM - 6.0 x 3.5mm, surface mount Momentary Reset Switch SMD <https://www.sparkfun.com/products/8229> (COM-08229) SMD-6.2MM-TALL - 6.2mm square, surface mount Tactile Button - SMD (6mm) <https://www.sparkfun.com/products/12992> Used on SparkFun Digital Sandbox <https://www.sparkfun.com/products/12651> SMD-RIGHT-ANGLE - Right-angle, surface mount Used on SparkFun Block for Intel® Edison - Arduino <https://www.sparkfun.com/products/13036>; PROD_ID: SWCH-08441; SF_SKU: COM-00097
TP1-TP5 = LinkedLibrary52101:TESTPOINT_TPS: TEST POINT PAD; BOM: EXCLUDE
U1 = RASPBERRYPI4_4GB:RASPBERRYPI4_4GB: BCM2835 Raspberry Pi Model B+ - ARM11, VideoCore MPU Embedded Evaluation Board Check availability <https://pricing.snapeda.com/parts/RASPBERRY%20PI%204B/4GB/Raspberry%20Pi/view-part?ref=eda>; AVAILABILITY: In Stock; DESCRIPTION: BCM2711 Raspberry Pi 4 Model B 4GB - ARM® Cortex®-A72 MPU Embedded Evaluation Board; MF: Raspberry Pi; MP: RASPBERRY PI 4B/4GB; PACKAGE: None; PRICE: None; PURCHASE-URL: https://pricing.snapeda.com/search/part/RASPBERRY PI 4B/4GB/?ref=eda
U2 = USBLC6-4SC6Y:USBLC6-4SC6Y: None Check availability <https://pricing.snapeda.com/parts/USBLC6-4SC6Y/STMicroelectronics/view-part?ref=eda>; AVAILABILITY: In Stock; DESCRIPTION: 17V Clamp 5A (8/20µs) Ipp Tvs Diode Surface Mount SOT-23-6; MF: STMicroelectronics; MP: USBLC6-4SC6Y; PACKAGE: SOT-23-6 STMicroelectronics; PRICE: None; PURCHASE-URL: https://pricing.snapeda.com/search/part/USBLC6-4SC6Y/?ref=eda
U3 = ST1L05CPU33R:ST1L05CPU33R: None Check availability <https://pricing.snapeda.com/parts/ST1L05CPU33R/STMicroelectronics/view-part?ref=eda>; AVAILABILITY: In Stock; DESCRIPTION: Linear Voltage Regulator IC Positive Fixed 1 Output 1.3A 6-DFN (3x3); MF: STMicroelectronics; MP: ST1L05CPU33R; PACKAGE: DFN-6 STMicroelectronics; PRICE: None; PURCHASE-URL: https://pricing.snapeda.com/search/part/ST1L05CPU33R/?ref=eda
U4-U7 = circles:TLE9251VSJXUMA1
U8-U11 = circles:ACT1210D
U12-U15 = circles:PESD2CANFD27V-T
U16 = circles:STM32H723ZGT
U17 = MCP4261-103E_ML:MCP4261-103E/ML: None Check availability <https://pricing.snapeda.com/parts/MCP4261-103E/ML/Microchip/view-part?ref=eda>; AVAILABILITY: In Stock; DESCRIPTION: Digital Potentiometer 10kOhm 256POS Non-Volatile Linear Automotive 16-Pin QFN EP Tube; MF: Microchip; MP: MCP4261-103E/ML; PACKAGE: QFN-16 Microchip; PRICE: None; PURCHASE-URL: https://pricing.snapeda.com/search/part/MCP4261-103E/ML/?ref=eda
X1 = circles:NX2016SA-32MHZ-EXS00A-CS06654; COPYRIGHT: Copyright (C) 2022 Ultra Librarian. All rights reserved.; MANUFACTURER_PART_NUMBER: NX2016SA-32MHZ-EXS00A-CS06654; MFR_NAME: NDK